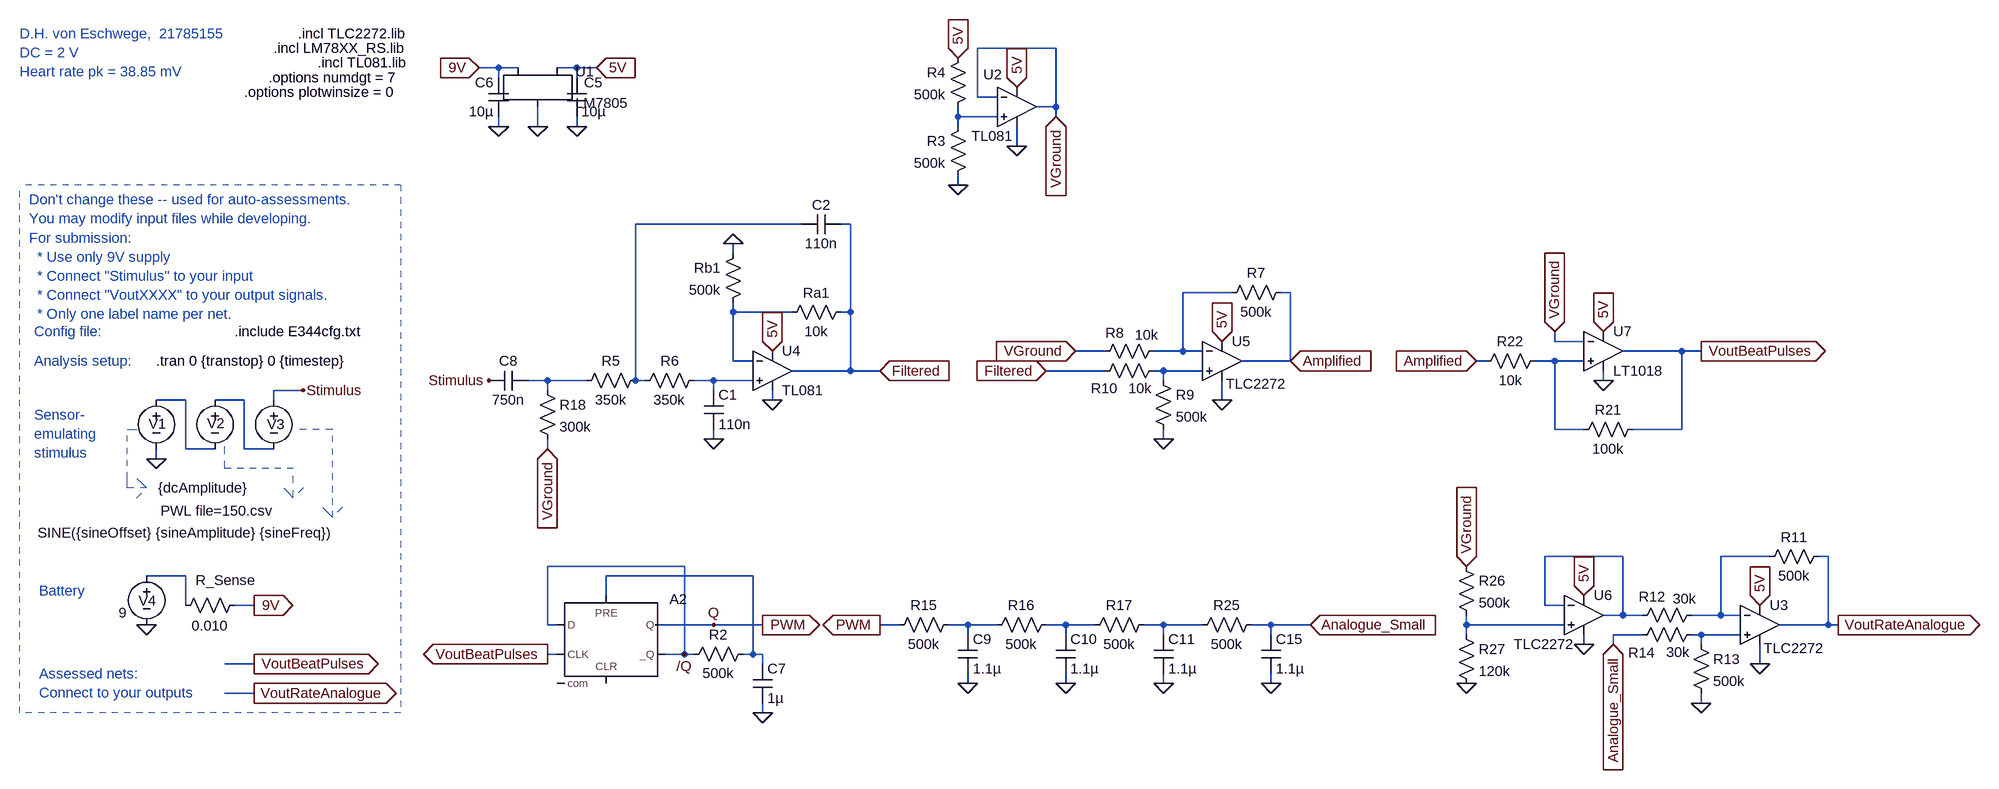
[diagram p0: schematic _FINAL.asc]
_FINAL.asc, the LTspice schematic file:
Version 4
SHEET 1 1824 680
WIRE -608 -1632 -736 -1632
WIRE -1520 -1600 -1552 -1600
WIRE -1488 -1600 -1520 -1600
WIRE -1392 -1600 -1424 -1600
WIRE -1360 -1600 -1392 -1600
WIRE -1520 -1584 -1520 -1600
WIRE -1392 -1584 -1392 -1600
WIRE -736 -1552 -736 -1632
WIRE -704 -1552 -736 -1552
WIRE -608 -1536 -608 -1632
WIRE -608 -1536 -640 -1536
WIRE -768 -1520 -768 -1536
WIRE -704 -1520 -768 -1520
WIRE -608 -1520 -608 -1536
WIRE -1520 -1504 -1520 -1520
WIRE -1456 -1504 -1456 -1536
WIRE -1392 -1504 -1392 -1520
WIRE -768 -1504 -768 -1520
WIRE -672 -1472 -672 -1504
WIRE -768 -1408 -768 -1424
WIRE -1024 -1344 -1296 -1344
WIRE -944 -1344 -960 -1344
WIRE -1136 -1296 -1136 -1312
WIRE -320 -1232 -400 -1232
WIRE -224 -1232 -240 -1232
WIRE -1136 -1200 -1136 -1216
WIRE -1040 -1200 -1136 -1200
WIRE -944 -1200 -944 -1344
WIRE -944 -1200 -960 -1200
WIRE 208 -1152 208 -1168
WIRE 256 -1152 208 -1152
WIRE -528 -1136 -576 -1136
WIRE -400 -1136 -400 -1232
WIRE -400 -1136 -448 -1136
WIRE -368 -1136 -400 -1136
WIRE 416 -1136 320 -1136
WIRE 448 -1136 416 -1136
WIRE -1136 -1120 -1136 -1200
WIRE -1104 -1120 -1136 -1120
WIRE -224 -1120 -224 -1232
WIRE -224 -1120 -304 -1120
WIRE 96 -1120 80 -1120
WIRE 208 -1120 176 -1120
WIRE 256 -1120 208 -1120
WIRE -944 -1104 -944 -1200
WIRE -944 -1104 -1040 -1104
WIRE -896 -1104 -944 -1104
WIRE -528 -1104 -624 -1104
WIRE -432 -1104 -448 -1104
WIRE -368 -1104 -432 -1104
WIRE -1440 -1088 -1472 -1088
WIRE -1376 -1088 -1440 -1088
WIRE -1296 -1088 -1296 -1344
WIRE -1280 -1088 -1296 -1088
WIRE -1168 -1088 -1200 -1088
WIRE -1104 -1088 -1168 -1088
WIRE -432 -1088 -432 -1104
WIRE 288 -1088 288 -1104
WIRE -1840 -1072 -1888 -1072
WIRE -1440 -1072 -1440 -1088
WIRE -1168 -1072 -1168 -1088
WIRE -2032 -1056 -2080 -1056
WIRE -1936 -1056 -1984 -1056
WIRE -1888 -1056 -1888 -1072
WIRE -1072 -1056 -1072 -1072
WIRE -336 -1056 -336 -1088
WIRE 208 -1008 208 -1120
WIRE 256 -1008 208 -1008
WIRE 416 -1008 416 -1136
WIRE 416 -1008 336 -1008
WIRE -1168 -992 -1168 -1008
WIRE -432 -992 -432 -1008
WIRE -2032 -976 -2032 -1056
WIRE -1984 -976 -2032 -976
WIRE -1936 -976 -1936 -1056
WIRE -1888 -976 -1936 -976
WIRE -1440 -976 -1440 -992
WIRE -2080 -960 -2080 -976
WIRE 320 -800 192 -800
WIRE 560 -800 480 -800
WIRE 656 -800 640 -800
WIRE -1216 -784 -1440 -784
WIRE -2032 -768 -2096 -768
WIRE -1104 -768 -1344 -768
WIRE -1344 -736 -1344 -768
WIRE -2032 -720 -2032 -768
WIRE -1920 -720 -1952 -720
WIRE 192 -720 192 -800
WIRE 224 -720 192 -720
WIRE 320 -704 320 -800
WIRE 320 -704 288 -704
WIRE 352 -704 320 -704
WIRE 480 -704 480 -800
WIRE 480 -704 432 -704
WIRE 512 -704 480 -704
WIRE -1440 -688 -1440 -784
WIRE -1424 -688 -1440 -688
WIRE -1168 -688 -1264 -688
WIRE -1088 -688 -1168 -688
WIRE -864 -688 -896 -688
WIRE -752 -688 -784 -688
WIRE -704 -688 -752 -688
WIRE -592 -688 -624 -688
WIRE -544 -688 -592 -688
WIRE -432 -688 -464 -688
WIRE -368 -688 -432 -688
WIRE -256 -688 -288 -688
WIRE -192 -688 -256 -688
WIRE 64 -688 64 -704
WIRE 224 -688 64 -688
WIRE 656 -688 656 -800
WIRE 656 -688 576 -688
WIRE 672 -688 656 -688
WIRE -752 -672 -752 -688
WIRE -592 -672 -592 -688
WIRE -432 -672 -432 -688
WIRE -256 -672 -256 -688
WIRE 64 -672 64 -688
WIRE 352 -672 304 -672
WIRE 448 -672 432 -672
WIRE 512 -672 448 -672
WIRE 256 -656 256 -672
WIRE 304 -656 304 -672
WIRE 448 -656 448 -672
WIRE -1424 -640 -1440 -640
WIRE -1216 -640 -1216 -784
WIRE -1216 -640 -1248 -640
WIRE -1200 -640 -1216 -640
WIRE -1104 -640 -1104 -768
WIRE -1104 -640 -1120 -640
WIRE -1088 -640 -1104 -640
WIRE -1920 -624 -1968 -624
WIRE -1088 -624 -1088 -640
WIRE 544 -624 544 -656
WIRE -752 -592 -752 -608
WIRE -592 -592 -592 -608
WIRE -432 -592 -432 -608
WIRE -256 -592 -256 -608
WIRE -1920 -576 -1968 -576
WIRE 448 -560 448 -576
WIRE -1088 -544 -1088 -560
FLAG -2080 -960 0
FLAG -1840 -1072 Stimulus
FLAG -1920 -720 9V
IOPIN -1920 -720 Out
FLAG -2096 -688 0
FLAG -1920 -624 VoutBeatPulses
IOPIN -1920 -624 Out
FLAG -1920 -576 VoutRateAnalogue
IOPIN -1920 -576 Out
FLAG -1456 -1504 0
FLAG -1552 -1600 9V
IOPIN -1552 -1600 In
FLAG -1520 -1504 0
FLAG -1392 -1504 0
FLAG -1360 -1600 5V
IOPIN -1360 -1600 In
FLAG -768 -1408 0
FLAG -768 -1616 5V
IOPIN -768 -1616 In
FLAG -672 -1472 0
FLAG -672 -1568 5V
IOPIN -672 -1568 In
FLAG -608 -1520 VGround
IOPIN -608 -1520 In
FLAG -1072 -1056 0
FLAG -1168 -992 0
FLAG -1136 -1312 0
FLAG -1072 -1136 5V
IOPIN -1072 -1136 In
FLAG -336 -1056 0
FLAG -432 -992 0
FLAG -336 -1152 5V
IOPIN -336 -1152 In
FLAG 288 -1168 5V
IOPIN 288 -1168 In
FLAG 288 -1088 0
FLAG -1536 -1088 Stimulus
FLAG -1440 -976 VGround
IOPIN -1440 -976 In
FLAG 448 -1136 VoutBeatPulses
IOPIN 448 -1136 Out
FLAG -896 -1104 Filtered
IOPIN -896 -1104 In
FLAG -624 -1104 Filtered
IOPIN -624 -1104 In
FLAG -224 -1120 Amplified
IOPIN -224 -1120 In
FLAG 80 -1120 Amplified
IOPIN 80 -1120 In
FLAG -576 -1136 VGround
IOPIN -576 -1136 In
FLAG 208 -1168 VGround
IOPIN 208 -1168 In
FLAG -1168 -688 Q
FLAG -1216 -640 /Q
FLAG -1088 -544 0
FLAG -1440 -640 VoutBeatPulses
IOPIN -1440 -640 Out
FLAG -1088 -688 PWM
IOPIN -1088 -688 Out
FLAG 544 -624 0
FLAG 448 -560 0
FLAG 544 -720 5V
IOPIN 544 -720 In
FLAG 304 -656 Analogue_Small
IOPIN 304 -656 In
FLAG -752 -592 0
FLAG -592 -592 0
FLAG -432 -592 0
FLAG -256 -592 0
FLAG -192 -688 Analogue_Small
IOPIN -192 -688 In
FLAG -896 -688 PWM
IOPIN -896 -688 Out
FLAG 672 -688 VoutRateAnalogue
IOPIN 672 -688 Out
FLAG 256 -656 0
FLAG 256 -736 5V
IOPIN 256 -736 In
FLAG 64 -592 0
FLAG 64 -784 VGround
IOPIN 64 -784 In
SYMBOL voltage -1984 -1072 R0
WINDOW 123 0 0 Left 0
WINDOW 39 0 0 Left 0
WINDOW 3 -89 197 Left 2
WINDOW 0 -13 54 Left 2
SYMATTR Value PWL file=150.csv
SYMATTR InstName V2
SYMBOL voltage -1888 -1072 R0
WINDOW 123 24 44 Left 2
WINDOW 39 0 0 Left 0
WINDOW 3 -386 233 Left 2
WINDOW 0 -11 56 Left 2
SYMATTR Value SINE({sineOffset} {sineAmplitude} {sineFreq})
SYMATTR InstName V3
SYMBOL voltage -2080 -1072 R0
WINDOW 123 0 0 Left 0
WINDOW 39 0 0 Left 0
WINDOW 3 3 160 Left 2
WINDOW 0 -13 55 Left 2
SYMATTR Value {dcAmplitude}
SYMATTR InstName V1
SYMBOL voltage -2096 -784 R0
WINDOW 123 24 44 Left 2
WINDOW 39 0 0 Left 0
WINDOW 3 -46 76 Left 2
WINDOW 0 -13 57 Left 2
SYMATTR Value 9
SYMATTR InstName V4
SYMBOL res -1936 -736 R90
WINDOW 0 -9 30 VBottom 2
WINDOW 3 34 56 VTop 2
SYMATTR InstName R_Sense
SYMATTR Value 0.010
SYMBOL LM7805 -1456 -1584 R0
SYMATTR InstName U1
SYMBOL cap -1408 -1584 R0
WINDOW 0 28 8 Left 2
SYMATTR InstName C5
SYMATTR Value 10µ
SYMBOL cap -1504 -1584 M0
SYMATTR InstName C6
SYMATTR Value 10µ
SYMBOL res -752 -1520 M0
SYMATTR InstName R3
SYMATTR Value 500k
SYMBOL res -752 -1632 M0
SYMATTR InstName R4
SYMATTR Value 500k
SYMBOL Opamps\\opamp2 -672 -1600 R0
WINDOW 0 -55 11 Left 2
WINDOW 3 -74 112 Left 2
SYMATTR InstName U2
SYMATTR Value TL081
SYMBOL res -1280 -1104 R90
WINDOW 0 0 56 VBottom 2
WINDOW 3 32 56 VTop 2
SYMATTR InstName R5
SYMATTR Value 350k
SYMBOL cap -1184 -1072 R0
SYMATTR InstName C1
SYMATTR Value 110n
SYMBOL Opamps\\opamp2 -1072 -1168 R0
SYMATTR InstName U4
SYMATTR Value TL081
SYMBOL res -1184 -1104 R90
WINDOW 0 0 56 VBottom 2
WINDOW 3 32 56 VTop 2
SYMATTR InstName R6
SYMATTR Value 350k
SYMBOL res -944 -1216 R90
WINDOW 0 0 56 VBottom 2
WINDOW 3 32 56 VTop 2
SYMATTR InstName Ra1
SYMATTR Value 10k
SYMBOL res -1120 -1312 M0
SYMATTR InstName Rb1
SYMATTR Value 500k
SYMBOL cap -960 -1360 R90
WINDOW 0 0 32 VBottom 2
WINDOW 3 32 32 VTop 2
SYMATTR InstName C2
SYMATTR Value 110n
SYMBOL res -224 -1248 R90
WINDOW 0 0 56 VBottom 2
WINDOW 3 32 56 VTop 2
SYMATTR InstName R7
SYMATTR Value 500k
SYMBOL res -432 -1152 R90
WINDOW 0 2 80 VBottom 2
WINDOW 3 -26 27 VTop 2
SYMATTR InstName R8
SYMATTR Value 10k
SYMBOL Opamps\\opamp2 -336 -1184 R0
WINDOW 3 6 102 Left 2
SYMATTR Value TLC2272
SYMATTR InstName U5
SYMBOL res -448 -1104 R0
SYMATTR InstName R9
SYMATTR Value 500k
SYMBOL res -432 -1120 R90
WINDOW 0 61 97 VBottom 2
WINDOW 3 29 38 VTop 2
SYMATTR InstName R10
SYMATTR Value 10k
SYMBOL Comparators\\LT1018 288 -1136 R0
SYMATTR InstName U7
SYMBOL cap -1472 -1072 M270
WINDOW 0 32 32 VTop 2
WINDOW 3 0 32 VBottom 2
SYMATTR InstName C8
SYMATTR Value 750n
SYMBOL res -1456 -1088 R0
SYMATTR InstName R18
SYMATTR Value 300k
SYMBOL res 352 -1024 R90
WINDOW 0 0 56 VBottom 2
WINDOW 3 32 56 VTop 2
SYMATTR InstName R21
SYMATTR Value 100k
SYMBOL res 192 -1136 R90
WINDOW 0 0 56 VBottom 2
WINDOW 3 32 56 VTop 2
SYMATTR InstName R22
SYMATTR Value 10k
SYMBOL Digital\\dflop -1344 -736 R0
SYMATTR InstName A2
SYMATTR SpiceLine Vhigh 5 Trise 10n
SYMBOL res -1104 -656 R90
WINDOW 0 0 56 VBottom 2
WINDOW 3 32 56 VTop 2
SYMATTR InstName R2
SYMATTR Value 500k
SYMBOL cap -1104 -624 R0
SYMATTR InstName C7
SYMATTR Value 1µ
SYMBOL res 656 -816 R90
WINDOW 0 0 56 VBottom 2
WINDOW 3 32 56 VTop 2
SYMATTR InstName R11
SYMATTR Value 500k
SYMBOL res 448 -720 R90
WINDOW 0 2 80 VBottom 2
WINDOW 3 -26 27 VTop 2
SYMATTR InstName R12
SYMATTR Value 30k
SYMBOL Opamps\\opamp2 544 -752 R0
WINDOW 3 6 102 Left 2
SYMATTR Value TLC2272
SYMATTR InstName U3
SYMBOL res 432 -672 R0
SYMATTR InstName R13
SYMATTR Value 500k
SYMBOL res 448 -688 R90
WINDOW 0 61 97 VBottom 2
WINDOW 3 29 38 VTop 2
SYMATTR InstName R14
SYMATTR Value 30k
SYMBOL res -768 -704 R90
WINDOW 0 0 56 VBottom 2
WINDOW 3 32 56 VTop 2
SYMATTR InstName R15
SYMATTR Value 500k
SYMBOL cap -768 -672 R0
SYMATTR InstName C9
SYMATTR Value 1.1µ
SYMBOL res -608 -704 R90
WINDOW 0 0 56 VBottom 2
WINDOW 3 32 56 VTop 2
SYMATTR InstName R16
SYMATTR Value 500k
SYMBOL cap -608 -672 R0
SYMATTR InstName C10
SYMATTR Value 1.1µ
SYMBOL res -448 -704 R90
WINDOW 0 0 56 VBottom 2
WINDOW 3 32 56 VTop 2
SYMATTR InstName R17
SYMATTR Value 500k
SYMBOL cap -448 -672 R0
SYMATTR InstName C11
SYMATTR Value 1.1µ
SYMBOL res -272 -704 R90
WINDOW 0 0 56 VBottom 2
WINDOW 3 32 56 VTop 2
SYMATTR InstName R25
SYMATTR Value 500k
SYMBOL cap -272 -672 R0
SYMATTR InstName C15
SYMATTR Value 1.1µ
SYMBOL Opamps\\opamp2 256 -768 R0
WINDOW 3 -115 112 Left 2
SYMATTR Value TLC2272
SYMATTR InstName U6
SYMBOL res 48 -800 R0
SYMATTR InstName R26
SYMATTR Value 500k
SYMATTR SpiceLine tol=60k
SYMBOL res 48 -688 R0
SYMATTR InstName R27
SYMATTR Value 120k
TEXT -2080 -1120 Left 2 !.tran 0 {transtop} 0 {timestep}
TEXT -1952 -1168 Left 2 !.include E344cfg.txt
TEXT -2288 -1384 Left 2 ;Don't change these -- used for auto-assessments.\nYou may modify input files while developing.\nFor submission: \n  * Use only 9V supply \n  * Connect "Stimulus" to your input\n  * Connect "VoutXXXX" to your output signals.\n  * Only one label name per net.
TEXT -2280 -1168 Left 2 ;Config file:
TEXT -2280 -1120 Left 2 ;Analysis setup:
TEXT -2272 -744 Left 2 ;Battery
TEXT -2280 -1032 Left 2 ;Sensor-\nemulating \nstimulus
TEXT -2272 -608 Left 2 ;Assessed nets:\nConnect to your outputs
TEXT -2304 -1656 Left 2 ;D.H. von Eschwege,  21785155\nDC = 2 V\nHeart rate pk = 38.85 mV
TEXT -1848 -1656 Left 2 !.incl TLC2272.lib
TEXT -1888 -1632 Left 2 !.incl LM78XX_RS.lib
TEXT -1816 -1608 Left 2 !.incl TL081.lib
TEXT -1896 -1584 Left 2 !.options numdgt = 7
TEXT -1936 -1560 Left 2 !.options plotwinsize = 0
LINE Normal -1792 -1008 -1856 -1008 2
LINE Normal -1792 -864 -1792 -1008 2
LINE Normal -1808 -880 -1792 -864 2
LINE Normal -1792 -864 -1808 -880 2
LINE Normal -1776 -880 -1792 -864 2
LINE Normal -2128 -1008 -2112 -1008 2
LINE Normal -2128 -928 -2128 -1008 2
LINE Normal -2128 -912 -2128 -928 2
LINE Normal -2096 -912 -2128 -912 2
LINE Normal -2112 -928 -2096 -912 2
LINE Normal -2096 -912 -2112 -928 2
LINE Normal -2112 -896 -2096 -912 2
LINE Normal -1968 -944 -1968 -992 2
LINE Normal -1856 -944 -1968 -944 2
LINE Normal -1856 -896 -1856 -944 2
LINE Normal -1872 -912 -1856 -896 2
LINE Normal -1856 -896 -1872 -912 2
LINE Normal -1840 -912 -1856 -896 2
LINE Normal -2304 -544 -2304 -1408 1
LINE Normal -1680 -1408 -1680 -544 1
LINE Normal -1680 -544 -2304 -544 1
LINE Normal -1680 -1408 -2304 -1408 1

The netlist it stands for:
* _FINAL.asc
V2 N010 N009 PWL file=150.csv
V3 Stimulus N010 SINE({sineOffset} {sineAmplitude} {sineFreq})
V1 N009 0 {dcAmplitude}
V4 N013 0 9
R_Sense 9V N013 0.010
XU1 9V 0 5V LM7805
C5 5V 0 10µ
C6 9V 0 10µ
R3 N001 0 500k
R4 5V N001 500k
XU2 N001 VGround 5V 0 VGround TL081  ; pins In+ In- V+ V- OUT
R5 N002 N007 350k
C1 N008 0 110n
XU4 N008 N004 5V 0 Filtered TL081  ; pins In+ In- V+ V- OUT
R6 N008 N002 350k
Ra1 Filtered N004 10k
Rb1 0 N004 500k
C2 Filtered N002 110n
R7 Amplified N003 500k
R8 N003 VGround 10k
XU5 N006 N003 5V 0 Amplified TLC2272  ; pins In+ In- V+ V- OUT
R9 N006 0 500k
R10 N006 Filtered 10k
XU7 N005 VGround 5V 0 VoutBeatPulses LT1018  ; pins In+ In- V+ V- OUT
C8 N007 Stimulus 750n
R18 N007 VGround 300k
R21 VoutBeatPulses N005 100k
R22 N005 Amplified 10k
A2 /Q 0 VoutBeatPulses N014 0 /Q PWM 0 DFLOP Vhigh 5 Trise 10n
R2 N014 /Q 500k
C7 N014 0 1µ
R11 VoutRateAnalogue N012 500k
R12 N012 N011 30k
XU3 N019 N012 5V 0 VoutRateAnalogue TLC2272  ; pins In+ In- V+ V- OUT
R13 N019 0 500k
R14 N019 Analogue_Small 30k
R15 N015 PWM 500k
C9 N015 0 1.1µ
R16 N016 N015 500k
C10 N016 0 1.1µ
R17 N017 N016 500k
C11 N017 0 1.1µ
R25 Analogue_Small N017 500k
C15 Analogue_Small 0 1.1µ
XU6 N018 N011 5V 0 N011 TLC2272  ; pins In+ In- V+ V- OUT
R26 VGround N018 500k tol=60k
R27 N018 0 120k
.tran 0 {transtop} 0 {timestep}
.include E344cfg.txt
* Don't change these -- used for auto-assessments.
* You may modify input files while developing.
* For submission:
*   * Use only 9V supply
*   * Connect "Stimulus" to your input
*   * Connect "VoutXXXX" to your output signals.
*   * Only one label name per net.
* Config file:
* Analysis setup:
* Battery
* Sensor-
* emulating
* stimulus
* Assessed nets:
* Connect to your outputs
* D.H. von Eschwege,  21785155
* DC = 2 V
* Heart rate pk = 38.85 mV
.incl TLC2272.lib
.incl LM78XX_RS.lib
.incl TL081.lib
.options numdgt = 7
.options plotwinsize = 0
.lib LTC1.lib
.backanno
.end